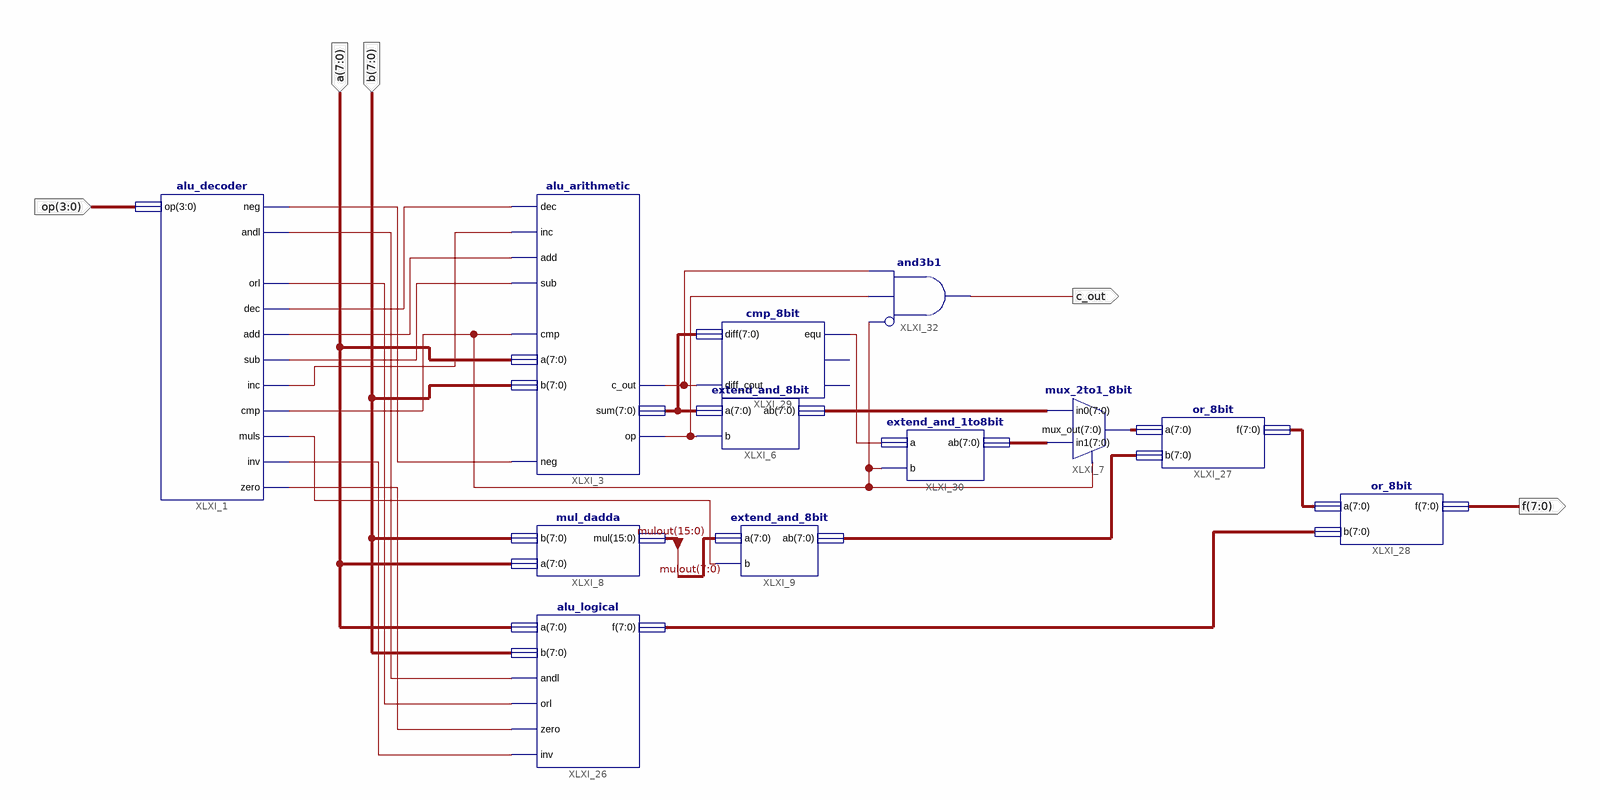
[diagram p0: schematic sheet 1]
// Xilinx ISE schematic alu_4bit.sch (spartan3e) as structural Verilog: 12 symbols, 5 ports
module alu_4bit (
  input  [3:0] op,
  input  [7:0] b,
  input  [7:0] a,
  output [7:0] f,
  output c_out
);

  wire XLXN_5, XLXN_6, XLXN_7, XLXN_8, XLXN_20, XLXN_36, XLXN_37, XLXN_38, XLXN_40, XLXN_41, XLXN_56,
       XLXN_57, XLXN_65, XLXN_66;
  wire [7:0] XLXN_11, XLXN_13, XLXN_21, XLXN_42, XLXN_43, XLXN_46, XLXN_58;
  wire [15:0] mulout;

  alu_decoder XLXI_1 (
    .op(op), .inv(XLXN_40), .andl(XLXN_36), .zero(XLXN_38), .orl(XLXN_37), .dec(XLXN_5), .add(XLXN_7),
    .sub(XLXN_8), .inc(XLXN_6), .cmp(XLXN_56), .muls(XLXN_20), .neg(XLXN_41));
  alu_arithmetic XLXI_3 (
    .dec(XLXN_5), .inc(XLXN_6), .add(XLXN_7), .sub(XLXN_8), .a(a), .b(b), .cmp(XLXN_56), .sum(XLXN_11),
    .c_out(XLXN_65), .op(XLXN_66), .neg(XLXN_41));
  extend_and_8bit XLXI_6 (.a(XLXN_11), .b(XLXN_66), .ab(XLXN_13));
  mux_2to1_8bit XLXI_7 (.in0(XLXN_13), .sel(XLXN_56), .mux_out(XLXN_43), .in1(XLXN_58));
  mul_dadda XLXI_8 (.b(b), .a(a), .mul(mulout));
  extend_and_8bit XLXI_9 (.a(mulout[7:0]), .b(XLXN_20), .ab(XLXN_21));
  alu_logical XLXI_26 (.a(a), .b(b), .andl(XLXN_36), .orl(XLXN_37), .zero(XLXN_38), .inv(XLXN_40), .f(XLXN_42));
  or_8bit XLXI_27 (.a(XLXN_43), .b(XLXN_21), .f(XLXN_46));
  or_8bit XLXI_28 (.a(XLXN_46), .b(XLXN_42), .f(f));
  cmp_8bit XLXI_29 (.diff(XLXN_11), .diff_cout(XLXN_65), .equ(XLXN_57));  // open: lt, gt
  extend_and_1to8bit XLXI_30 (.a(XLXN_57), .b(XLXN_56), .ab(XLXN_58));
  and XLXI_32 (c_out, ~XLXN_56, XLXN_66, XLXN_65);  // and3b1
endmodule
